# EAGLE schematic ISO1724_TEST (EAGLE 9.6.2)
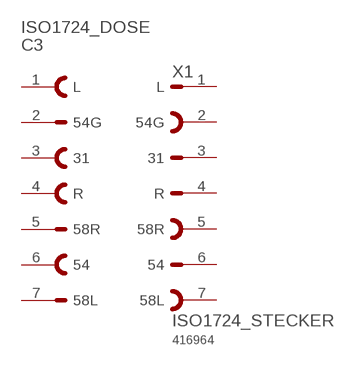
[diagram p0: schematic, sheet 1]

## Parts
C3  ISO1724_DOSE  [ISO1724_DOSE]
X1  ISO1724_STECKER  [ISO1724_STECKER]
Unconnected: C3.1(L) C3.2(54G) C3.3 C3.4(R) C3.5(58R) C3.6 C3.7(58L) X1.1(L) X1.2(54G) X1.3 X1.4(R) X1.5(58R) X1.6 X1.7(58L)

## Library data of the parts
C3 = ISO1724:ISO1724_DOSE
X1 = ISO1724:ISO1724_STECKER; ARTIKEL_NR: 416964